# EAGLE design TG16_buffer (EAGLE 7.7.0)
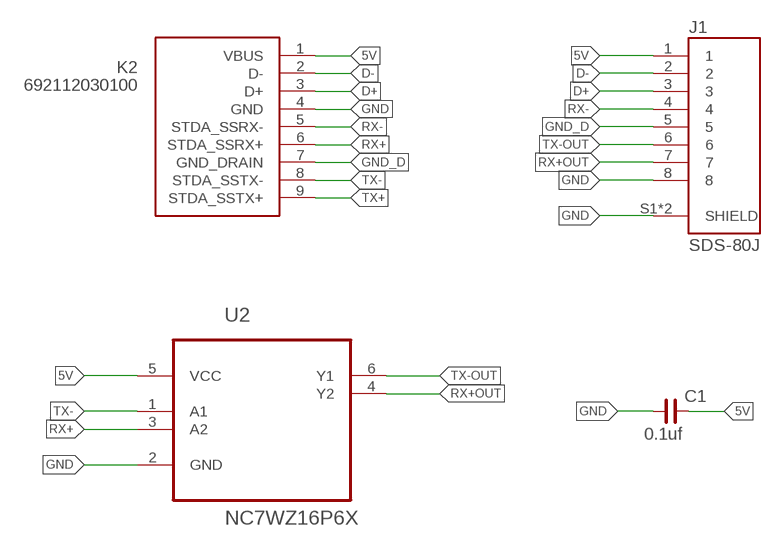
[diagram p0: schematic, sheet 1]

## Parts
C1  0.1uf  C_0805  [C0805]
J1  SDS-80J  [CUI_SDS-80J]
K2  692112030100  [692112030100]
U2  NC7WZ16P6X  [SOT65P210X110-6N]

## Nets
5V: C1.2 J1.1 K2.1(VBUS) U2.5(VCC)
D+: J1.3 K2.3(D+)
D-: J1.2 K2.2(D-)
GND: C1.1 J1.8 J1.S1(SHIELD) J1.S2(SHIELD) K2.4(GND) U2.2(GND)
GND_D: J1.5 K2.7(GND_DRAIN)
RX+: K2.6(STDA_SSRX+) U2.3(A2)
RX+OUT: J1.7 U2.4(Y2)
RX-: J1.4 K2.5(STDA_SSRX-)
TX+: K2.9(STDA_SSTX+)
TX-: K2.8(STDA_SSTX-) U2.1(A1)
TX-OUT: J1.6 U2.6(Y1)

## Library data of the parts
C1 = rc-master-smd:C_: NON-POLARIZED CAP
J1 = SDS-80J:SDS-80J: Standard Din Connector 8 Pin, Right-Angle Receptacle; AVAILABILITY: Unavailable; CUI_PURCHASE_URL: https://www.cui.com/product/interconnect/connectors/din-connectors/sds-j-series?utm_source=snapeda.com&utm_medium=referral&utm_campaign=snapedaBOM; DESCRIPTION: 3~13 Positions, Receptacle, Right Angle, Through Hole, Standard Circular DIN Connector; MF: CUI Inc.; MP: SDS-80J; PACKAGE: None; PRICE: None
K2 = Wuerth_Elektronik_eiCan_Communication_Connectors_STENCIL:692112030100: WR-COM USB 3.0 SMT PLUG WITH CLIPTYPE A
U2 = NC7WZ16P6X:NC7WZ16P6X: Dual Buffer; AVAILABILITY: Unavailable; DESCRIPTION: NC7WZ16 Series 5.5 V Surface Mount TinyLogic UHS Dual Buffer - SC-70-6; MF: ON Semiconductor; MP: NC7WZ16P6X; PACKAGE: SC-70-6 ON Semiconductor; PRICE: None

## Board
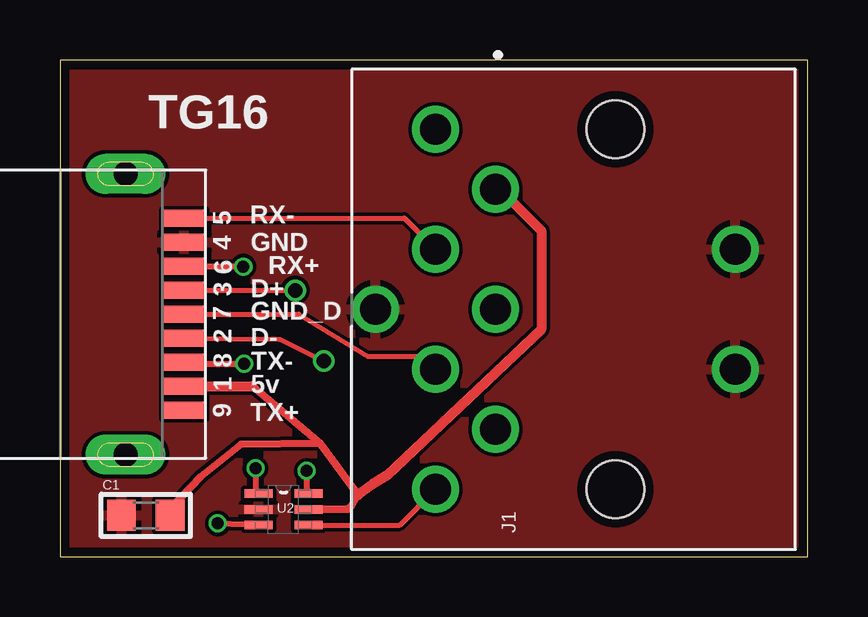
[diagram p1: board, top side]
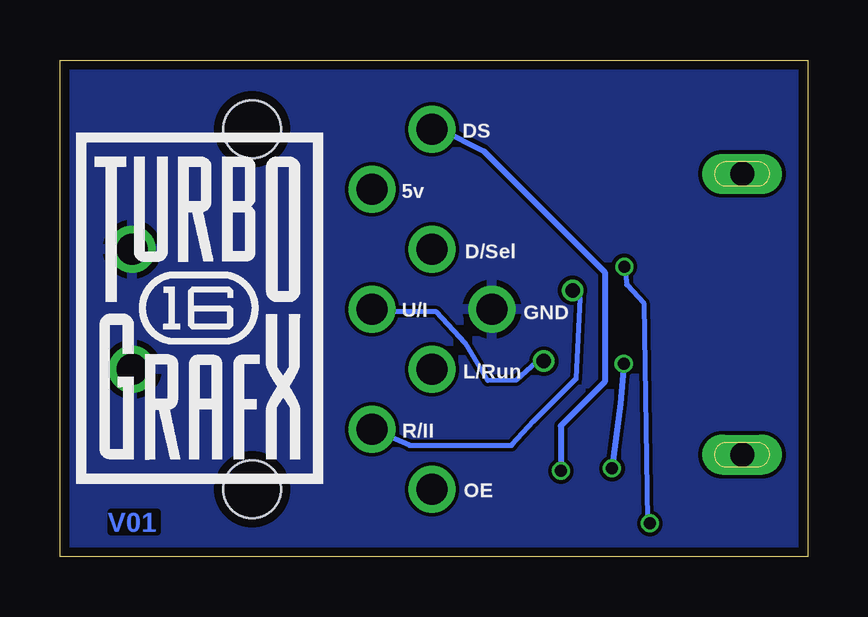
[diagram p2: board, bottom side, seen from below]

Size 31.17 x 20.7 mm. Coordinates in mm from the lower left corner, seen from the top.
Outline: 0,0 31.17,0 31.17,20.7 0,20.7 0,0
Copper layers (1*16): Top 0.035559375mm / dielectric 1.6mm / Bottom 0.035559375mm
Design rules "oshpark-2layer": minimum track width 6mil, minimum drill 10mil, track to track 6mil, track to pad 6mil, pad to pad 6mil, via to via 6mil, smd to smd 6mil, copper to edge 15mil, drill to drill 6mil, minimum pad ring 5mil, minimum via ring 5mil, stop-mask expansion 2.5mil, vias tented up to drill 0mil, thermal gap 10mil

### Footprints (pad centres in the part's own frame; a part is rotated, then mirrored left to right if it is on the bottom)
C0805 = smd 1.2 x 1.3: 1 -1.016,0; 2 1.016,0
CUI_SDS-80J = drill 1.3: 1 5,0; 2 0,0; 3 -5,0; 4 2.5,2.5; 5 -2.5,2.5; 6 7.5,2.5; 7 -7.5,2.5; 8 0,5; S1 -2.5,-10; S2 2.5,-10 | hole 2.4: -7.5,-5; 7.5,-5
692112030100 = smd 0.7 x 1.8: 1 -3,0; 2 -1,0; 3 1,0; 4 3,0; 5 4,0; 6 2,0; 7 0,0; 8 -2,0; 9 -4,0 | drill 1 pad 1.676 long: Z1 5.85,2.45; Z2 -5.85,2.45
SOT65P210X110-6N = smd 1.168 x 0.356: 1 -1.041,0.66; 2 -1.041,0; 3 -1.041,-0.66; 4 1.041,-0.66; 5 1.041,0; 6 1.041,0.66

### Placement (x,y rotation side)
C1  3.58,1.73 0 top
J1  18.16,10.31 90 top
K2  5.18,10.11 90 top
U2  9.32,1.98 0 top

### Tracks (layer width: path | path; a pad name or v marks a point on that pad's centre or on a via)
5V
  Top 0.152: 4.65,1.8 C1.2 | 10.9,1.96 10.44,1.96 U2.5 | 5.26,7.14 K2.1 | 5.87,3.33 5.86,3.34
  Top 0.203: 4.65,1.8 4.65,2.06
  Top 0.305: 4.65,2.06 5.86,3.34 7.56,4.68 10.85,4.72 | 8.03,7.11 10.85,4.72 | 10.85,4.72 12.43,2.58 12.34,2.46 12.17,2.13 12.01,1.98 10.92,1.98 10.9,1.96
  Top 0.406: K2.1 8.03,7.11 | J1.1 18.34,15.31 20.07,13.59 20.07,9.47 13.61,3.38 13.03,3.02 12.43,2.58
D+  (via drill 0.6)
  Top 0.203: K2.3 8.83,11.11 v9.8,11.1
  Bottom 0.203: v9.8,11.1 9.5,10.8 9.65,7.42 11.4,5.66 12.32,4.67 12.34,4.65 16.61,4.65 J1.3
D-  (via drill 0.6)
  Top 0.203: K2.2 9.15,9.06 v11,8.15
  Bottom 0.203: J1.2 18.06,10.21 15.47,10.21 14.28,8.89 13.34,7.34 12.14,7.37 11.3,8.1 v11,8.15
GND
  pour Bottom: -0.1,20.52 30.89,20.5 30.94,-0.08 0.1,-0.03
  pour Top: 0,20.55 30.96,20.6 30.84,0.25 0.05,0
GND_D
  Top 0.203: K2.7 9.96,10.11 12.83,8.36 15.12,8.36 J1.5
RX+  (via drill 0.5)
  Top 0.254: K2.6 7.83,12.11 v7.65,12.09 | v6.58,1.4 8.26,1.35 U2.3
  Bottom 0.203: v7.65,12.09 7.54,11.33 6.83,10.57 6.68,1.47
  Bottom 0.254: 6.68,1.47 v6.58,1.4
RX+OUT
  Top 0.203: U2.4 14.17,1.32 J1.7
RX-
  Top 0.203: K2.5 14.36,14.11 J1.4
TX-  (via drill 0.5)
  Top 0.152: 8.15,2.72 U2.1 | 5.26,8.05 K2.8
  Top 0.254: v8.15,3.68 8.15,2.72 | 5.26,8.05 v7.67,8.05
  Bottom 0.254: v8.15,3.68 7.8,6.38 v7.67,8.05
TX-OUT  (via drill 0.5)
  Top 0.152: 10.29,2.72 U2.6
  Top 0.254: v10.29,3.58 10.29,2.72
  Bottom 0.254: 15.68,17.83 J1.6 15.49,17.88 15.32,17.81 13.49,16.89 8.46,11.86 8.46,7.29 10.29,5.46 v10.29,3.58

### Text on the board
Bottom: V01
tPlace: TG16 | 5 | RX- | 4 | GND | 6 | RX+ | 3 | D+ | 7 | GND_D | 2 | D- | 8 | TX- | 1 | 5v | 9 | TX+
bPlace: DS | 5v | D/Sel | GND | U/I | L/Run | R/II | OE